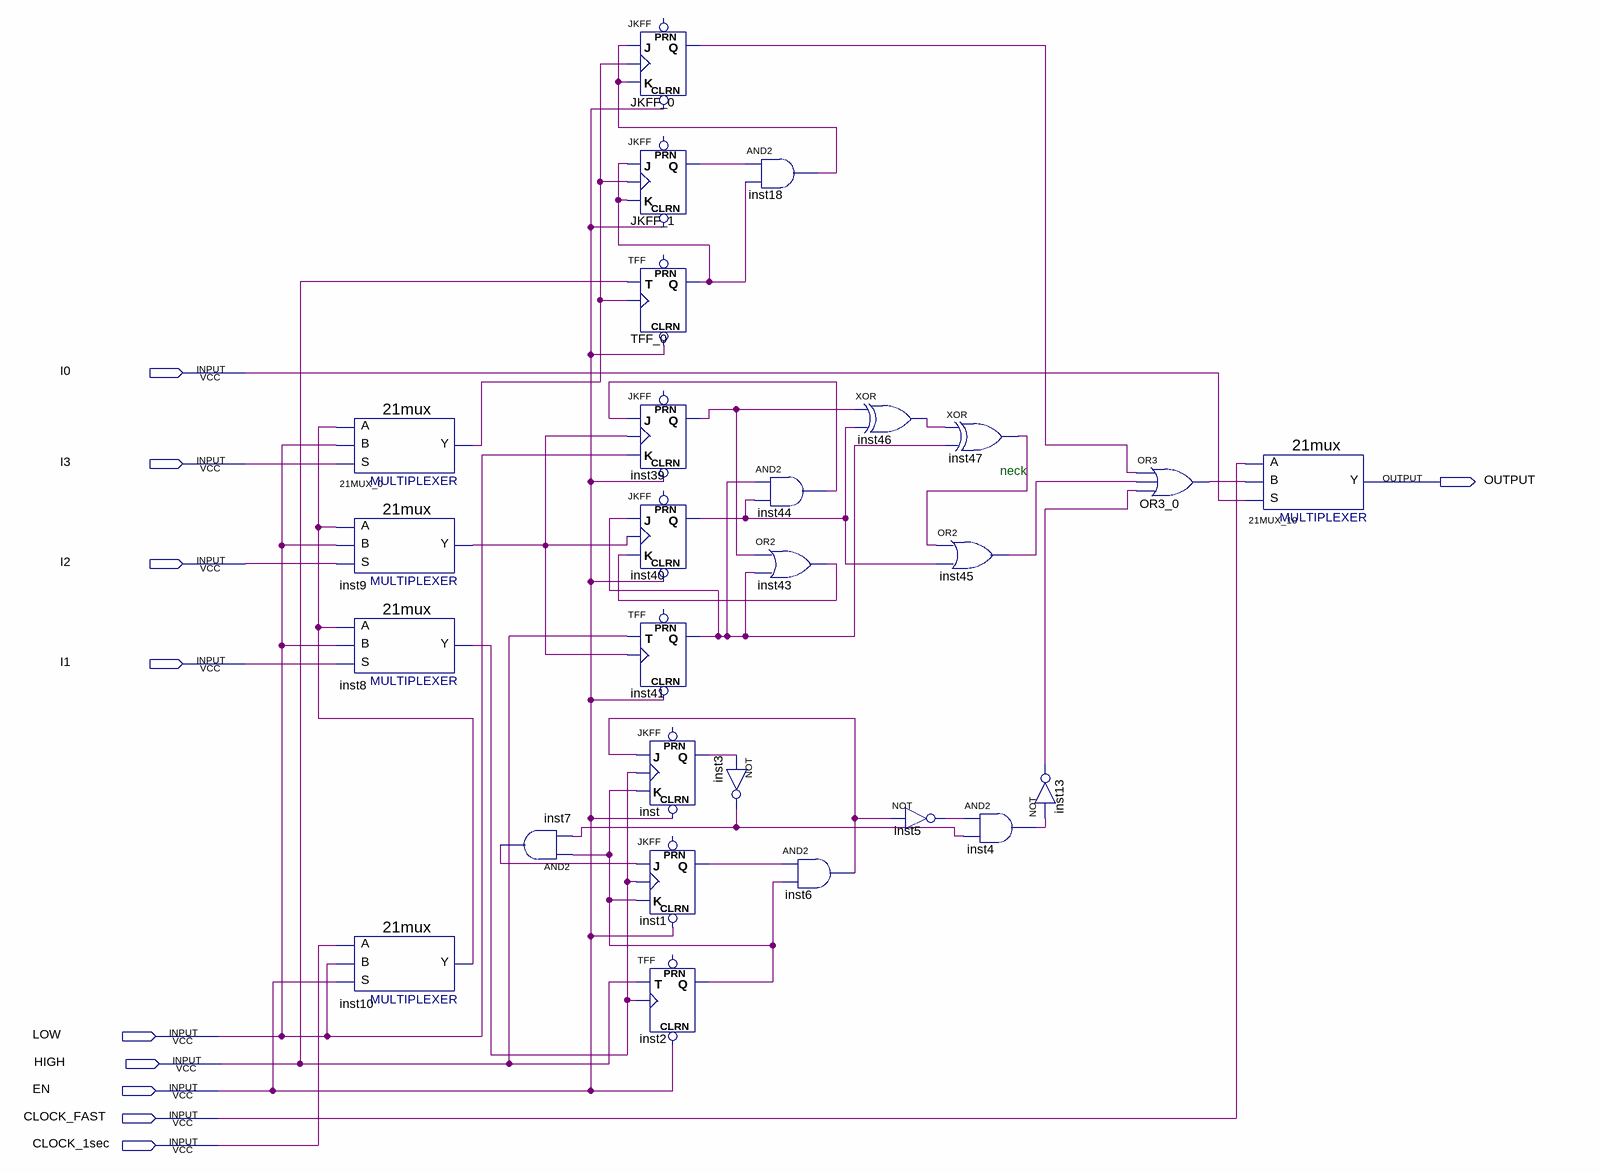
[diagram p0: schematic sheet]
// Quartus schematic rail_move.bdf as structural Verilog: 27 symbols, 10 pins
module rail_move (
  input  I0,
  input  I3,
  input  I2,
  input  I1,
  input  LOW,
  input  HIGH,
  input  EN,
  input  CLOCK_FAST,
  input  CLOCK_1sec,
  output OUTPUT
);

  wire inst1_q, inst2_q, inst3_out, inst4_out, inst5_out, inst6_out, inst7_out, inst8_y, inst9_y, inst10_y,
       inst13_out, inst18_out, inst39_q, inst40_q, inst41_q, inst43_out, inst44_out, inst45_out, inst46_out,
       inst47_out, inst_q, JKFF_0_q, JKFF_1_q, n21MUX_0_y, OR3_0_out, TFF_0_q;

  \21mux  u_21MUX_0 (.S(I3), .B(LOW), .A(inst10_y), .Y(n21MUX_0_y));
  \21mux  inst9 (.S(I2), .B(LOW), .A(inst10_y), .Y(inst9_y));
  \21mux  inst8 (.S(I1), .B(LOW), .A(inst10_y), .Y(inst8_y));
  \21mux  inst10 (.S(EN), .B(LOW), .A(CLOCK_1sec), .Y(inst10_y));
  and inst7 (inst7_out, inst2_q, inst3_out);
  JKFF JKFF_0 (.CLRN(EN), .K(inst18_out), .J(inst18_out), .CLK(n21MUX_0_y), .Q(JKFF_0_q));  // open: PRN
  JKFF JKFF_1 (.CLRN(EN), .K(TFF_0_q), .J(TFF_0_q), .CLK(n21MUX_0_y), .Q(JKFF_1_q));  // open: PRN
  TFF TFF_0 (.CLRN(EN), .T(HIGH), .CLK(n21MUX_0_y), .Q(TFF_0_q));  // open: PRN
  JKFF inst39 (.CLRN(EN), .K(LOW), .J(inst44_out), .CLK(inst9_y), .Q(inst39_q));  // open: PRN
  JKFF inst40 (.CLRN(EN), .K(inst43_out), .J(inst41_q), .CLK(inst9_y), .Q(inst40_q));  // open: PRN
  TFF inst41 (.CLRN(EN), .T(HIGH), .CLK(inst9_y), .Q(inst41_q));  // open: PRN
  JKFF inst (.CLRN(EN), .K(inst2_q), .J(inst6_out), .CLK(inst8_y), .Q(inst_q));  // open: PRN
  JKFF inst1 (.CLRN(EN), .K(inst2_q), .J(inst7_out), .CLK(inst8_y), .Q(inst1_q));  // open: PRN
  TFF inst2 (.CLRN(EN), .T(HIGH), .CLK(inst8_y), .Q(inst2_q));  // open: PRN
  and inst18 (inst18_out, JKFF_1_q, TFF_0_q);
  and inst44 (inst44_out, inst41_q, inst40_q);
  or inst43 (inst43_out, inst39_q, inst41_q);
  not inst3 (inst3_out, inst_q);
  and inst6 (inst6_out, inst1_q, inst2_q);
  xor inst46 (inst46_out, inst39_q, inst40_q);
  not inst5 (inst5_out, inst6_out);
  xor inst47 (inst47_out, inst46_out, inst41_q);
  or inst45 (inst45_out, inst47_out, inst40_q);
  and inst4 (inst4_out, inst5_out, inst3_out);
  not inst13 (inst13_out, inst4_out);
  or OR3_0 (OR3_0_out, JKFF_0_q, inst45_out, inst13_out);
  \21mux  u_21MUX_10 (.S(I0), .B(OR3_0_out), .A(CLOCK_FAST), .Y(OUTPUT));

  // Notes on the sheet:
  //   neck         
endmodule
